# Altium schematic sheet Sheet1.SchDoc
size 594 x 420 mm; Razrabotal: {Разработал}; Prov: {Проверил}; Tkont: {Т. конт.}; Nkont: {Н. конт.}; Utv: {Утвердил}; Naimenovanie: {Наименование}; Oboznachenie: {Обозначение}; Shifr: {Шифр}
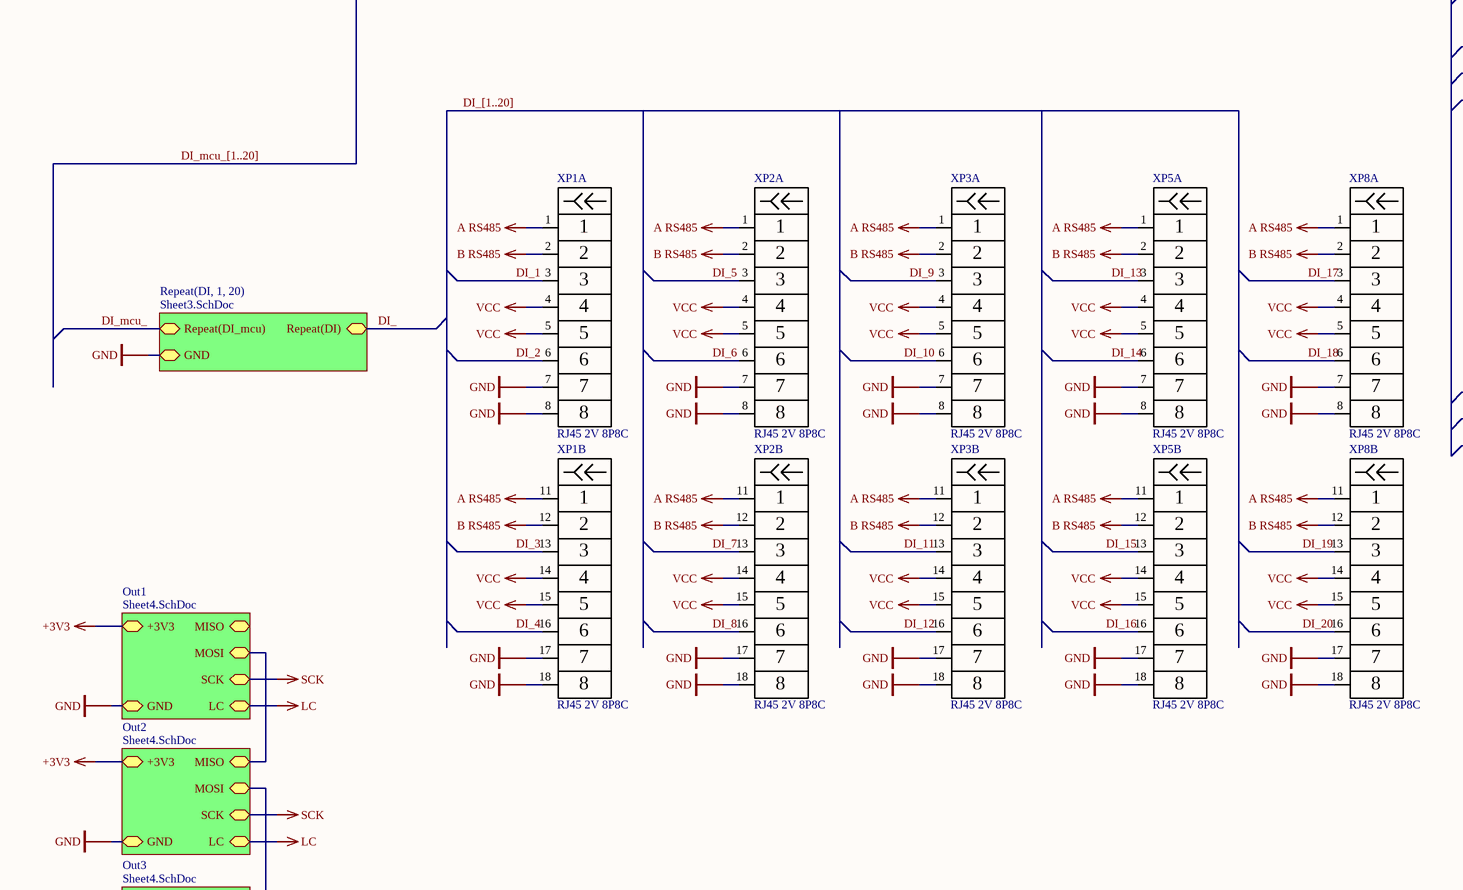
[diagram p0: Sheet1.SchDoc, top left]
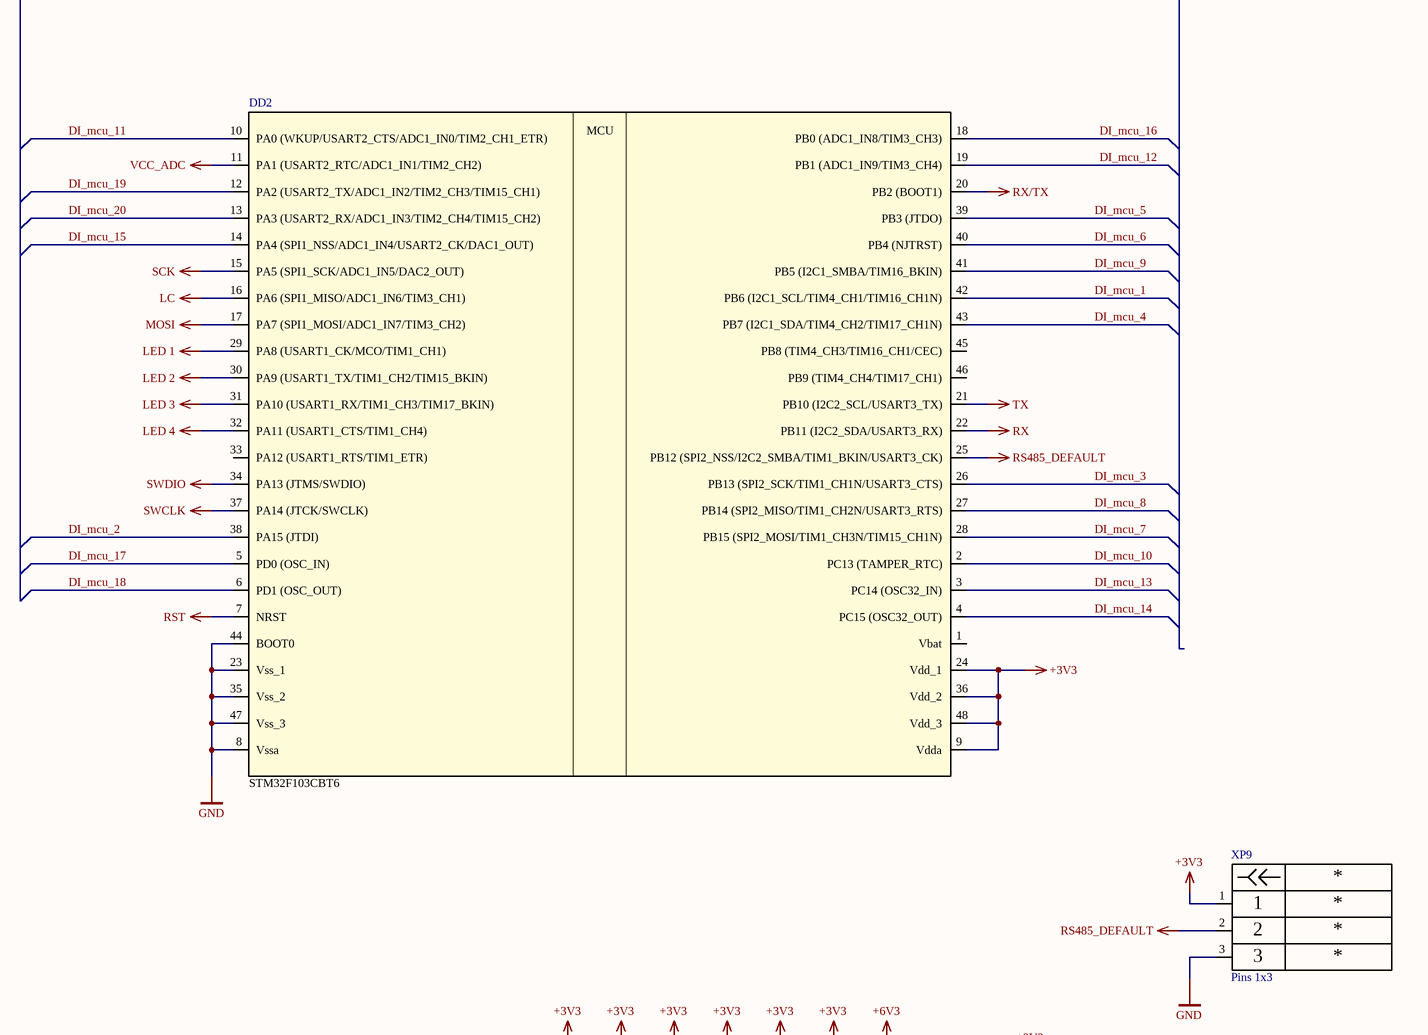
[diagram p1: Sheet1.SchDoc, top right]
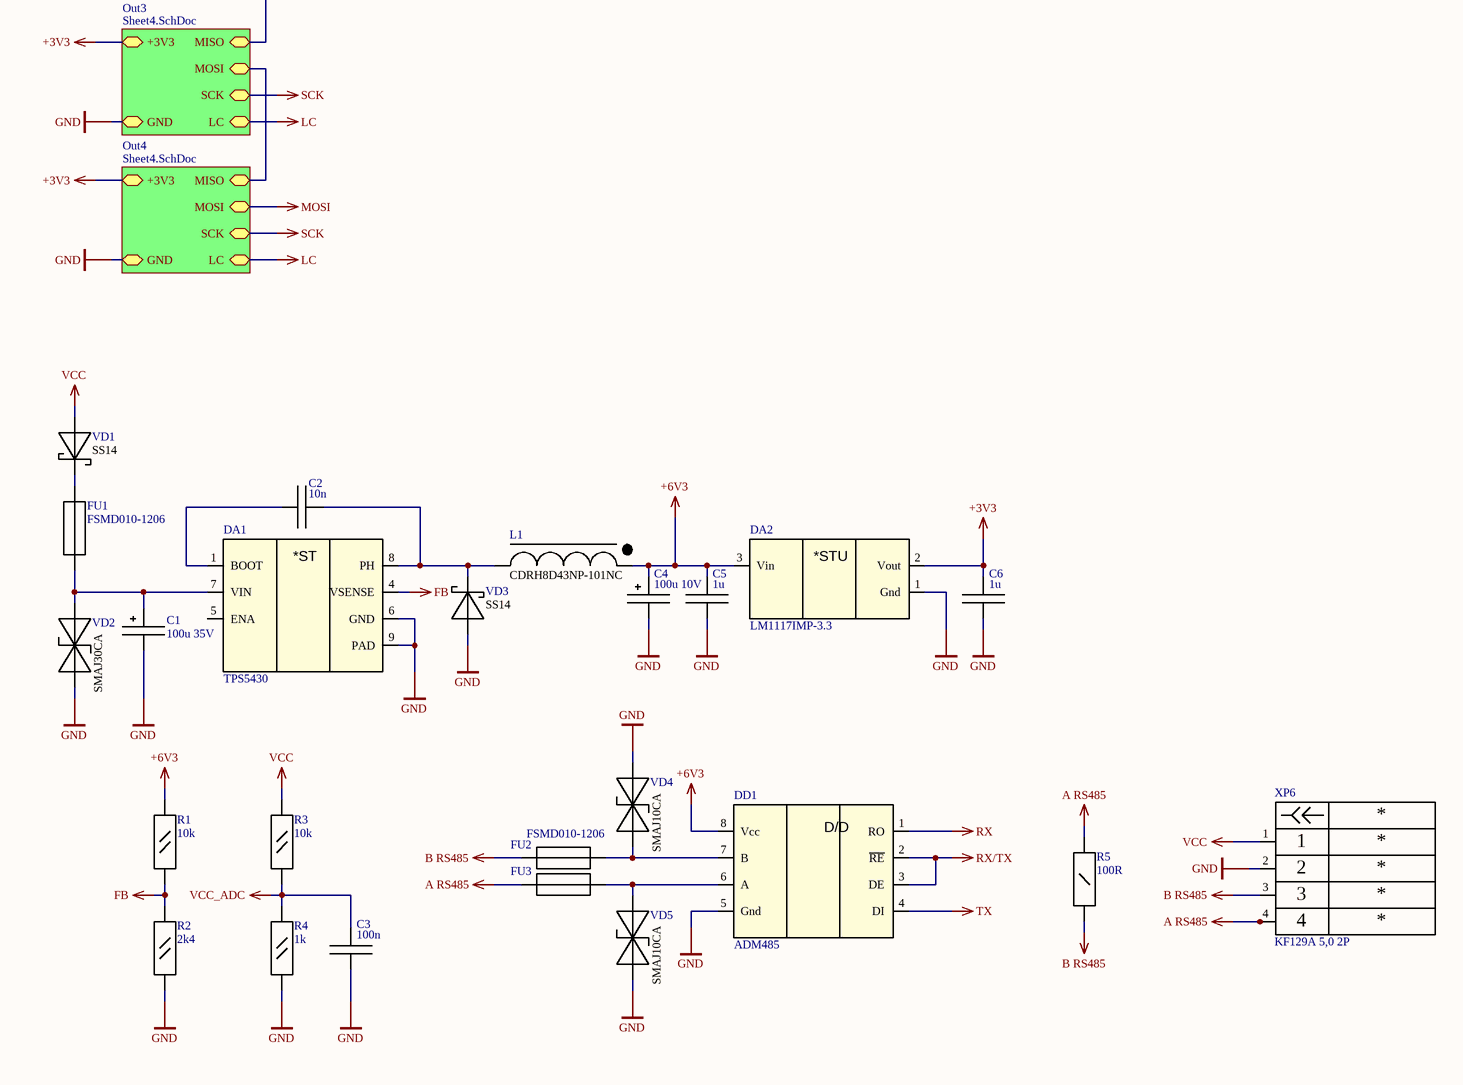
[diagram p2: Sheet1.SchDoc, bottom left]
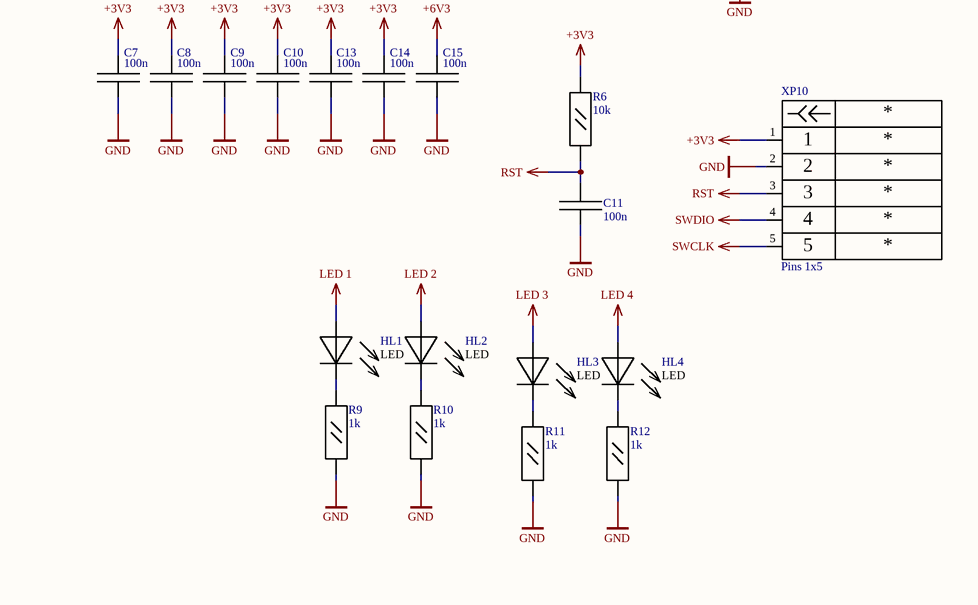
[diagram p3: Sheet1.SchDoc, bottom right]

## Parts
C1  100u 35V  [Cap electro d6.3x2.54mm]
C2  10n  [Cap Ceramic 0805]
C3  100n  [Cap Ceramic 0805]
C4  100u 10V  [Cap electro d6.3x2.54mm]
C5  1u  [Cap Ceramic 0805]
C6  1u  [Cap Ceramic 0805]
C7  100n  [Cap Ceramic 0805]
C8  100n  [Cap Ceramic 0805]
C9  100n  [Cap Ceramic 0805]
C10  100n  [Cap Ceramic 0805]
C11  100n  [Cap Ceramic 0805]
C13  100n  [Cap Ceramic 0805]
C14  100n  [Cap Ceramic 0805]
C15  100n  [Cap Ceramic 0805]
DA1  TPS5430  [SO8 S1.27W6.00 GP]
DA2  LM1117IMP-3.3  [SOT-232]
DD1  ADM485  [SO8 S1.27W6.00]
DD2  STM32F103CBT6  [TQFP48 S0.5]
FU1  FSMD010-1206  [Fuse 1206]
FU2  FSMD010-1206  [Fuse 1206]
FU3  FSMD010-1206  [Fuse 1206]  (value not drawn)
HL1  LED  [LED 0805]
HL2  LED  [LED 0805]
HL3  LED  [LED 0805]
HL4  LED  [LED 0805]
L1  CDRH8D43NP-101NC  [CDRH8D43NP-xxxNC]
R1  10k  [Resistor 0805]
R2  2k4  [Resistor 0805]
R3  10k  [Resistor 0805]
R4  1k  [Resistor 0805]
R5  100R  [Resistor 1206]
R6  10k  [Resistor 0805]
R9  1k  [Resistor 0805]
R10  1k  [Resistor 0805]
R11  1k  [Resistor 0805]
R12  1k  [Resistor 0805]
VD1  SS14  [DO-214AC SMA]
VD2  SMAJ30CA  [DO-214AC SMA]
VD3  SS14  [DO-214AC SMA]
VD4  SMAJ10CA  [DO-214AC SMA]
VD5  SMAJ10CA  [DO-214AC SMA]
XP1  RJ45 2V 8P8C  [RJ45 2V 8P8C]  (parts A,B of 2)
XP2  RJ45 2V 8P8C  [RJ45 2V 8P8C]  (parts A,B of 2)
XP3  RJ45 2V 8P8C  [RJ45 2V 8P8C]  (parts A,B of 2)
XP5  RJ45 2V 8P8C  [RJ45 2V 8P8C]  (parts A,B of 2)
XP6  KF129A 5,0 2P  [KF129A 5,0 2P]
XP8  RJ45 2V 8P8C  [RJ45 2V 8P8C]  (parts A,B of 2)
XP9  Pins 1x3  [Pins 1x3]
XP10  Pins 1x5  [Pins 1x5]

## Sub-sheets
Out1 = Sheet4.SchDoc: +3V3, GND, LC, MISO, MOSI, SCK
Out2 = Sheet4.SchDoc: +3V3, GND, LC, MISO, MOSI, SCK
Out3 = Sheet4.SchDoc: +3V3, GND, LC, MISO, MOSI, SCK
Out4 = Sheet4.SchDoc: +3V3, GND, LC, MISO, MOSI, SCK
Repeat(DI, 1, 20) = Sheet3.SchDoc: GND, Repeat(DI), Repeat(DI_mcu)

## Nets
+3V3: C6.2 C7.2 C8.2 C9.2 C10.2 C13.2 C14.2 DA2.2(Vout) DD2.9(Vdda) DD2.24(Vdd_1) DD2.36(Vdd_2) DD2.48(Vdd_3) R6.1 XP9.1 XP10.1 ; sheet Out1/+3V3, sheet Out2/+3V3, sheet Out3/+3V3, sheet Out4/+3V3
+6V3: C4.2 C5.2 C15.2 DA2.3(Vin) DD1.8(Vcc) L1.1 R1.1
A RS485: FU3.1 R5.1 XP1.1 XP1.11 XP2.1 XP2.11 XP3.1 XP3.11 XP5.1 XP5.11 XP6.4 XP8.1 XP8.11
B RS485: FU2.1 R5.2 XP1.2 XP1.12 XP2.2 XP2.12 XP3.2 XP3.12 XP5.2 XP5.12 XP6.3 XP8.2 XP8.12
FB: DA1.4(VSENSE) R1.2 R2.1
GND: C1.1 C3.1 C4.1 C5.1 C6.1 C7.1 C8.1 C9.1 C10.1 C11.1 C13.1 C14.1 C15.1 DA1.6(GND) DA1.9(PAD) DA2.1(Gnd) DD1.5(Gnd) DD2.8(Vssa) DD2.23(Vss_1) DD2.35(Vss_2) DD2.44(BOOT0) DD2.47(Vss_3) R2.2 R4.2 R9.2 R10.2 R11.2 R12.2 VD2.1 VD3.1(A) VD4.1 VD5.1 XP1.7 XP1.8 XP1.17 XP1.18 XP2.7 XP2.8 XP2.17 XP2.18 XP3.7 XP3.8 XP3.17 XP3.18 XP5.7 XP5.8 XP5.17 XP5.18 XP6.2 XP8.7 XP8.8 XP8.17 XP8.18 XP9.3 XP10.2 ; sheet Out1/GND, sheet Out2/GND, sheet Out3/GND, sheet Out4/GND, sheet Repeat(DI, 1, 20)/GND
LC: DD2.16(PA6_(SPI1_MISO/ADC1_IN6/TIM3_CH1)) ; sheet Out1/LC, sheet Out2/LC, sheet Out3/LC, sheet Out4/LC
LED 1: DD2.29(PA8_(USART1_CK/MCO/TIM1_CH1)) HL1.1(A)
LED 2: DD2.30(PA9_(USART1_TX/TIM1_CH2/TIM15_BKIN)) HL2.1(A)
LED 3: DD2.31(PA10_(USART1_RX/TIM1_CH3/TIM17_BKIN)) HL3.1(A)
LED 4: DD2.32(PA11_(USART1_CTS/TIM1_CH4)) HL4.1(A)
MOSI: DD2.17(PA7_(SPI1_MOSI/ADC1_IN7/TIM3_CH2)) ; sheet Out4/MOSI
RS485_DEFAULT: DD2.25(PB12_(SPI2_NSS/I2C2_SMBA/TIM1_BKIN/USART3_CK)) XP9.2
RST: C11.2 DD2.7(NRST) R6.2 XP10.3
RX: DD1.1(RO) DD2.22(PB11_(I2C2_SDA/USART3_RX))
RX/TX: DD1.2(~{RE}) DD1.3(DE) DD2.20(PB2_(BOOT1))
SCK: DD2.15(PA5_(SPI1_SCK/ADC1_IN5/DAC2_OUT)) ; sheet Out1/SCK, sheet Out2/SCK, sheet Out3/SCK, sheet Out4/SCK
SWCLK: DD2.37(PA14_(JTCK/SWCLK)) XP10.5
SWDIO: DD2.34(PA13_(JTMS/SWDIO)) XP10.4
TX: DD1.4(DI) DD2.21(PB10_(I2C2_SCL/USART3_TX))
VCC: R3.1 VD1.1(A) XP1.4 XP1.5 XP1.14 XP1.15 XP2.4 XP2.5 XP2.14 XP2.15 XP3.4 XP3.5 XP3.14 XP3.15 XP5.4 XP5.5 XP5.14 XP5.15 XP6.1 XP8.4 XP8.5 XP8.14 XP8.15
VCC_ADC: C3.2 DD2.11(PA1_(USART2_RTC/ADC1_IN1/TIM2_CH2)) R3.2 R4.1
DI_: sheet Repeat(DI, 1, 20)/Repeat(DI)
DI_1: XP1.3
DI_2: XP1.6
DI_3: XP1.13
DI_4: XP1.16
DI_5: XP2.3
DI_6: XP2.6
DI_7: XP2.13
DI_8: XP2.16
DI_9: XP3.3
DI_10: XP3.6
DI_11: XP3.13
DI_12: XP3.16
DI_13: XP5.3
DI_14: XP5.6
DI_15: XP5.13
DI_16: XP5.16
DI_17: XP8.3
DI_18: XP8.6
DI_19: XP8.13
DI_20: XP8.16
DI_mcu_: sheet Repeat(DI, 1, 20)/Repeat(DI_mcu)
DI_mcu_1: DD2.42(PB6_(I2C1_SCL/TIM4_CH1/TIM16_CH1N))
DI_mcu_2: DD2.38(PA15_(JTDI))
DI_mcu_3: DD2.26(PB13_(SPI2_SCK/TIM1_CH1N/USART3_CTS))
DI_mcu_4: DD2.43(PB7_(I2C1_SDA/TIM4_CH2/TIM17_CH1N))
DI_mcu_5: DD2.39(PB3_(JTDO))
DI_mcu_6: DD2.40(PB4_(NJTRST))
DI_mcu_7: DD2.28(PB15_(SPI2_MOSI/TIM1_CH3N/TIM15_CH1N))
DI_mcu_8: DD2.27(PB14_(SPI2_MISO/TIM1_CH2N/USART3_RTS))
DI_mcu_9: DD2.41(PB5_(I2C1_SMBA/TIM16_BKIN))
DI_mcu_10: DD2.2(PC13_(TAMPER_RTC))
DI_mcu_11: DD2.10(PA0_(WKUP/USART2_CTS/ADC1_IN0/TIM2_CH1_ETR))
DI_mcu_12: DD2.19(PB1_(ADC1_IN9/TIM3_CH4))
DI_mcu_13: DD2.3(PC14_(OSC32_IN))
DI_mcu_14: DD2.4(PC15_(OSC32_OUT))
DI_mcu_15: DD2.14(PA4_(SPI1_NSS/ADC1_IN4/USART2_CK/DAC1_OUT))
DI_mcu_16: DD2.18(PB0_(ADC1_IN8/TIM3_CH3))
DI_mcu_17: DD2.5(PD0_(OSC_IN))
DI_mcu_18: DD2.6(PD1_(OSC_OUT))
DI_mcu_19: DD2.12(PA2_(USART2_TX/ADC1_IN2/TIM2_CH3/TIM15_CH1))
DI_mcu_20: DD2.13(PA3_(USART2_RX/ADC1_IN3/TIM2_CH4/TIM15_CH2))
NetC1_2: C1.2 DA1.7(VIN) FU1.2 VD2.2
NetC2_1: C2.1 DA1.1(BOOT)
NetC2_2: C2.2 DA1.8(PH) L1.2 VD3.2(K)
NetDD1_6: DD1.6(A) FU3.2 VD5.2
NetDD1_7: DD1.7(B) FU2.2 VD4.2
NetFU1_1: FU1.1 VD1.2(K)
NetHL1_2: HL1.2(K) R9.1
NetHL2_2: HL2.2(K) R10.1
NetHL3_2: HL3.2(K) R11.1
NetHL4_2: HL4.2(K) R12.1
(unnamed): sheet Out1/MOSI, sheet Out2/MISO
(unnamed): sheet Out2/MOSI, sheet Out3/MISO
(unnamed): sheet Out3/MOSI, sheet Out4/MISO

Not connected (* = marked no-connect by the designer): DA1 2(NC) 3(NC) 5(ENA); DD2 1(Vbat) 33(PA12_(USART1_RTS/TIM1_ETR)) 45(PB8_(TIM4_CH3/TIM16_CH1/CEC)) 46(PB9_(TIM4_CH4/TIM17_CH1))

## Buses and harness runs
bus DI_[1..20]
bus DI_mcu_[1..20]

## Notes on the sheet
- Перв. примен.
- Спра. №
- Подп. и дата
- Инв. № бубл.
- Взам. инв. №
- Инв. № подл.
- Лист
- Изм
- № докум.
- Подпись
- Дата
- Копировал
- Формат А2
- (in symbol ADM485) D/D
- (in symbol LM1117IMP-x.x) *STU
- (in symbol STM32F100C4T6) MCU
- (in symbol TPS5430) *ST

## Library data of the parts
C1 C4 = ECap: Comments: *
C2 C3 C5-C11 C13-C15 = CerCap: Comments: *
DA2 = LM1117IMP-x.x: Comments: *
DD2 = STM32F100C4T6
FU1-FU3 = FSMDxxx-1206: Comments: *
L1 = CDRH8D43NP-xxxNC
R1-R4 R6 R9-R12 = Resistor 0,125W: Comments: *
R5 = Resistor 0,25W: Comments: *
VD2 VD4 VD5 = SMAJxxCA: Comments: *
DA1 = TPS5430: Comments: *
DD1 = ADM485: Comments: *
HL1-HL4 = LED: Comments: *
VD1 VD3 = SS14: Comments: *
XP1-XP3 XP5 XP8 = RJ45 2V 8P8C: Comments: *
XP6 = KF129A 5,0 2P: Comments: *; Name1: *; Name2: *; Name3: *; Name: *; Name4: *
XP9 = Pins 1x3: Comments: *; Name1: *; Name: *; Name2: *; Name3: *
XP10 = Pins 1x5: Comments: *; Name1: *; Name: *; Name2: *; Name3: *; Name4: *; Name5: *